# Altium schematic sheet IMU Sensor.SchDoc
size A4
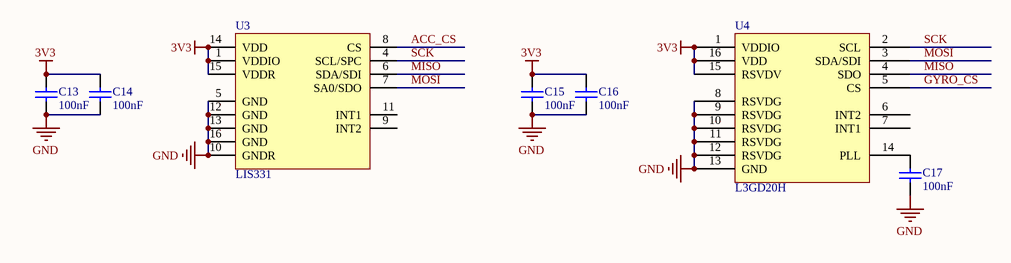
[diagram p0: IMU Sensor.SchDoc]

## Parts
C13  100nF  [0603-CAP]
C14  100nF  [0603-CAP]
C15  100nF  [0603-CAP]
C16  100nF  [0603-CAP]
C17  100nF  [0603-CAP]
U3  LIS331  [LGA16-3MM]
U4  L3GD20H  [LGA16-3MM]

## Nets
3V3: C13.2 C14.2 C15.2 C16.2 U3.1(VDDIO) U3.14(VDD) U3.15(VDDR) U4.1(VDDIO) U4.15(RSVDV) U4.16(VDD)
GND: C13.1 C14.1 C15.1 C16.1 C17.1 U3.5(GND) U3.10(GNDR) U3.12(GND) U3.13(GND) U3.16(GND) U4.8(RSVDG) U4.9(RSVDG) U4.10(RSVDG) U4.11(RSVDG) U4.12(RSVDG) U4.13(GND)
ACC_CS: U3.8(CS)
GYRO_CS: U4.5(CS)
MISO: U3.6(SDA/SDI) U4.4(SDO)
MOSI: U3.7(SA0/SDO) U4.3(SDA/SDI)
SCK: U3.4(SCL/SPC) U4.2(SCL)
NetC17_2: C17.2 U4.14(PLL)

Not connected (* = marked no-connect by the designer): U3 9(INT2) 11(INT1); U4 6(INT2) 7(INT1)

## Library data of the parts
C13-C17 = Cap: Capacitor; Published: 8-Jun-2000; LatestRevisionDate: 17-Jul-2002; LatestRevisionNote: Re-released for DXP Platform.; PackageReference: RAD-0.3; Publisher: Altium Limited; PackageDescription: Radial Cap, Thru-Hole; 2 Leads; 0.3 in Pin Spacing; Value: 100nF